# EAGLE board cpu_module (EAGLE 6.4)
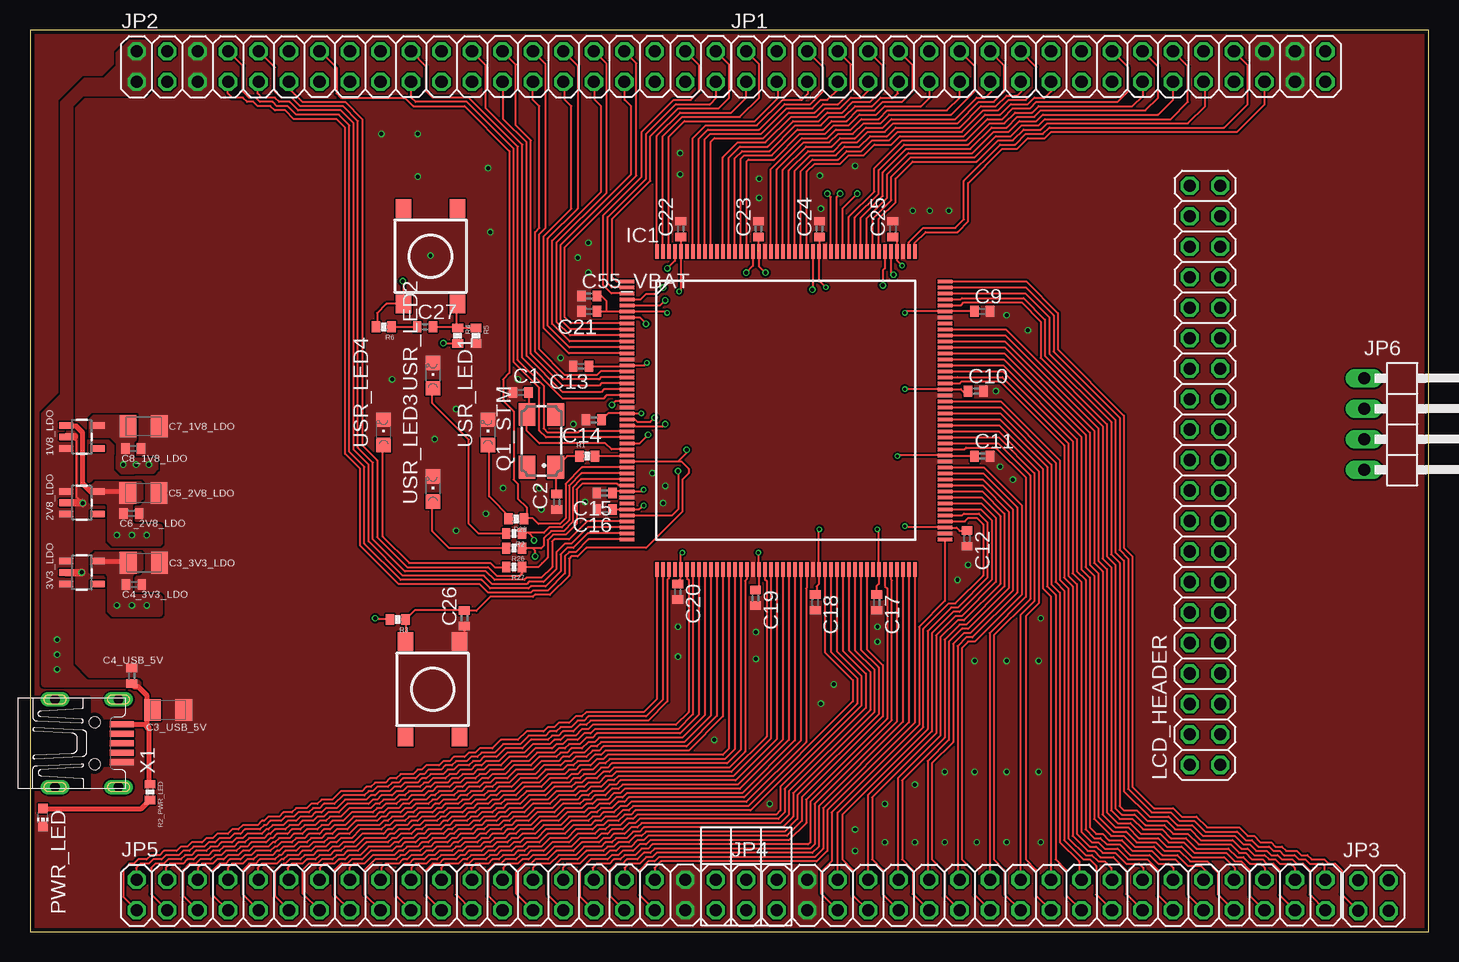
[diagram p3: board, top side]
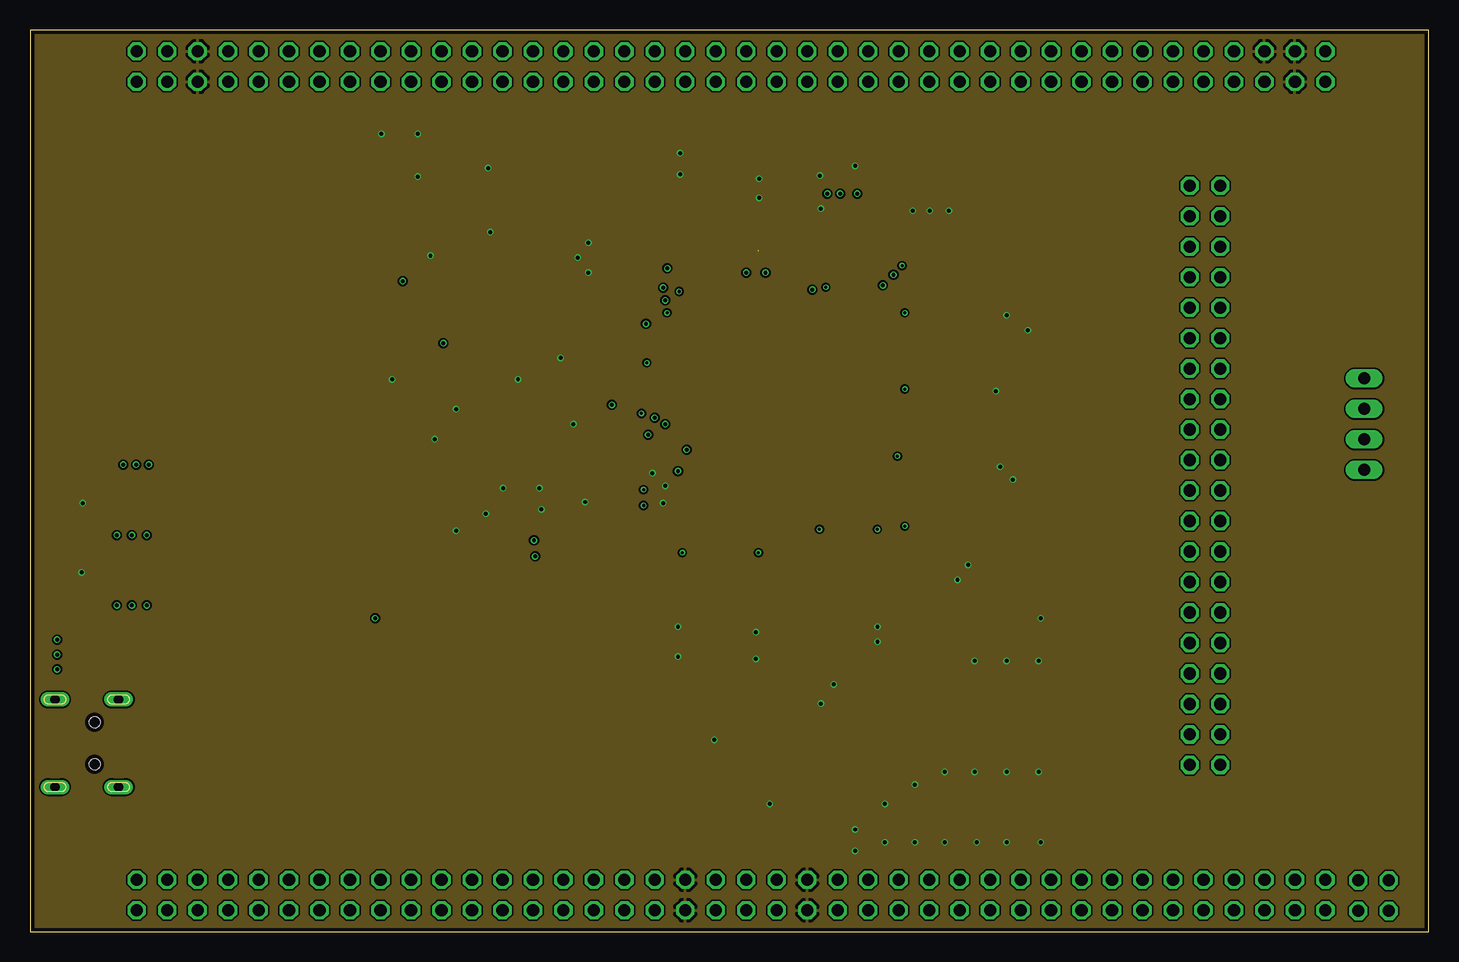
[diagram p4: board, inner layer Route2]
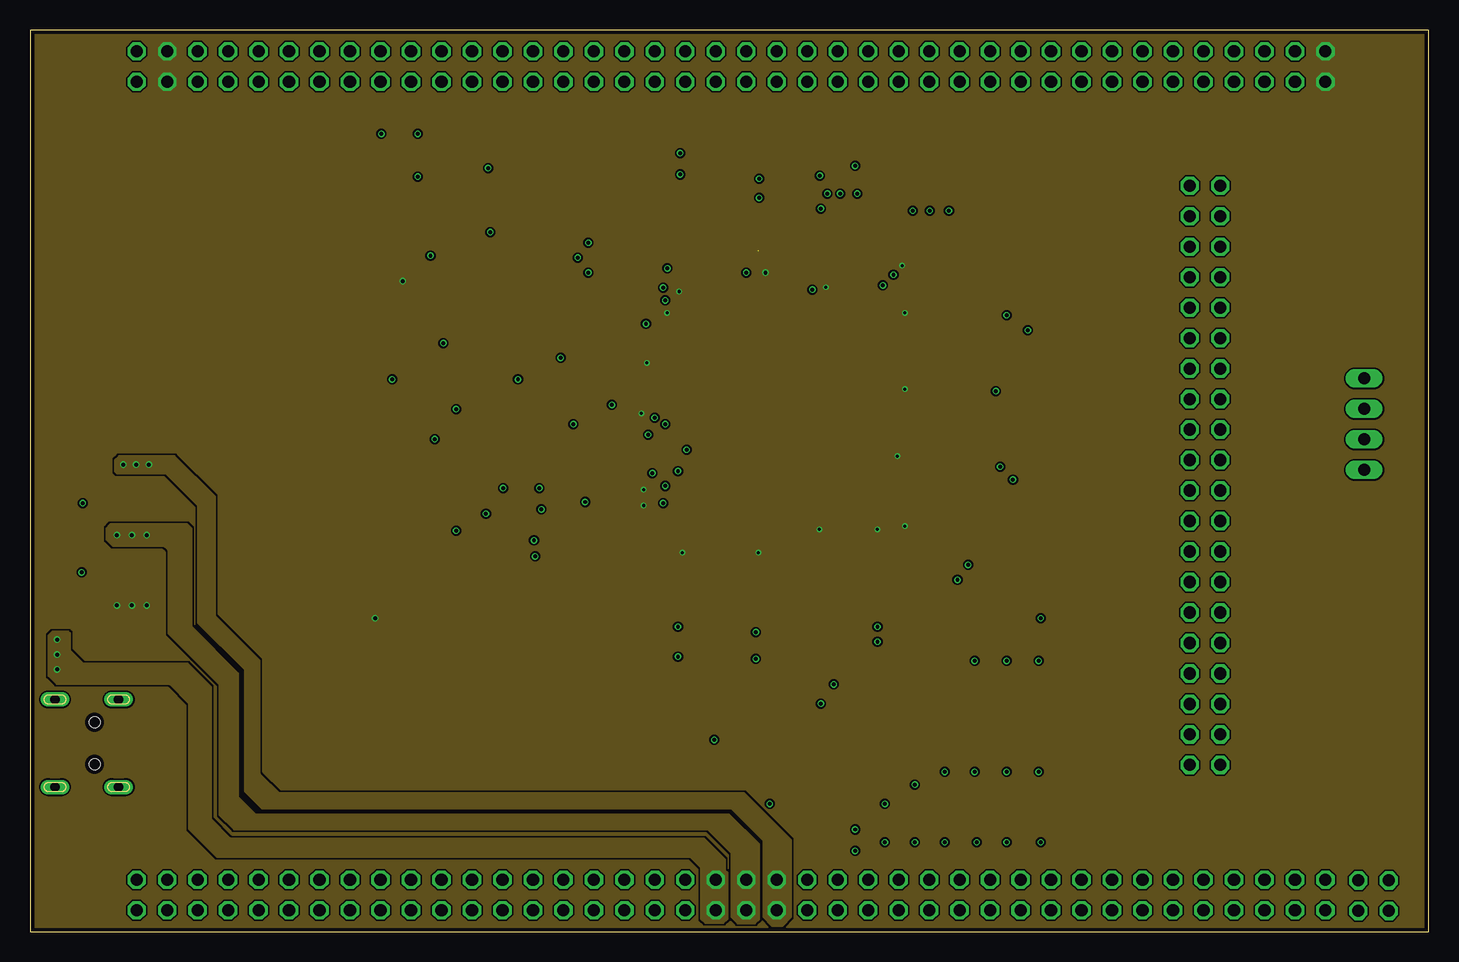
[diagram p5: board, inner layer Route3]
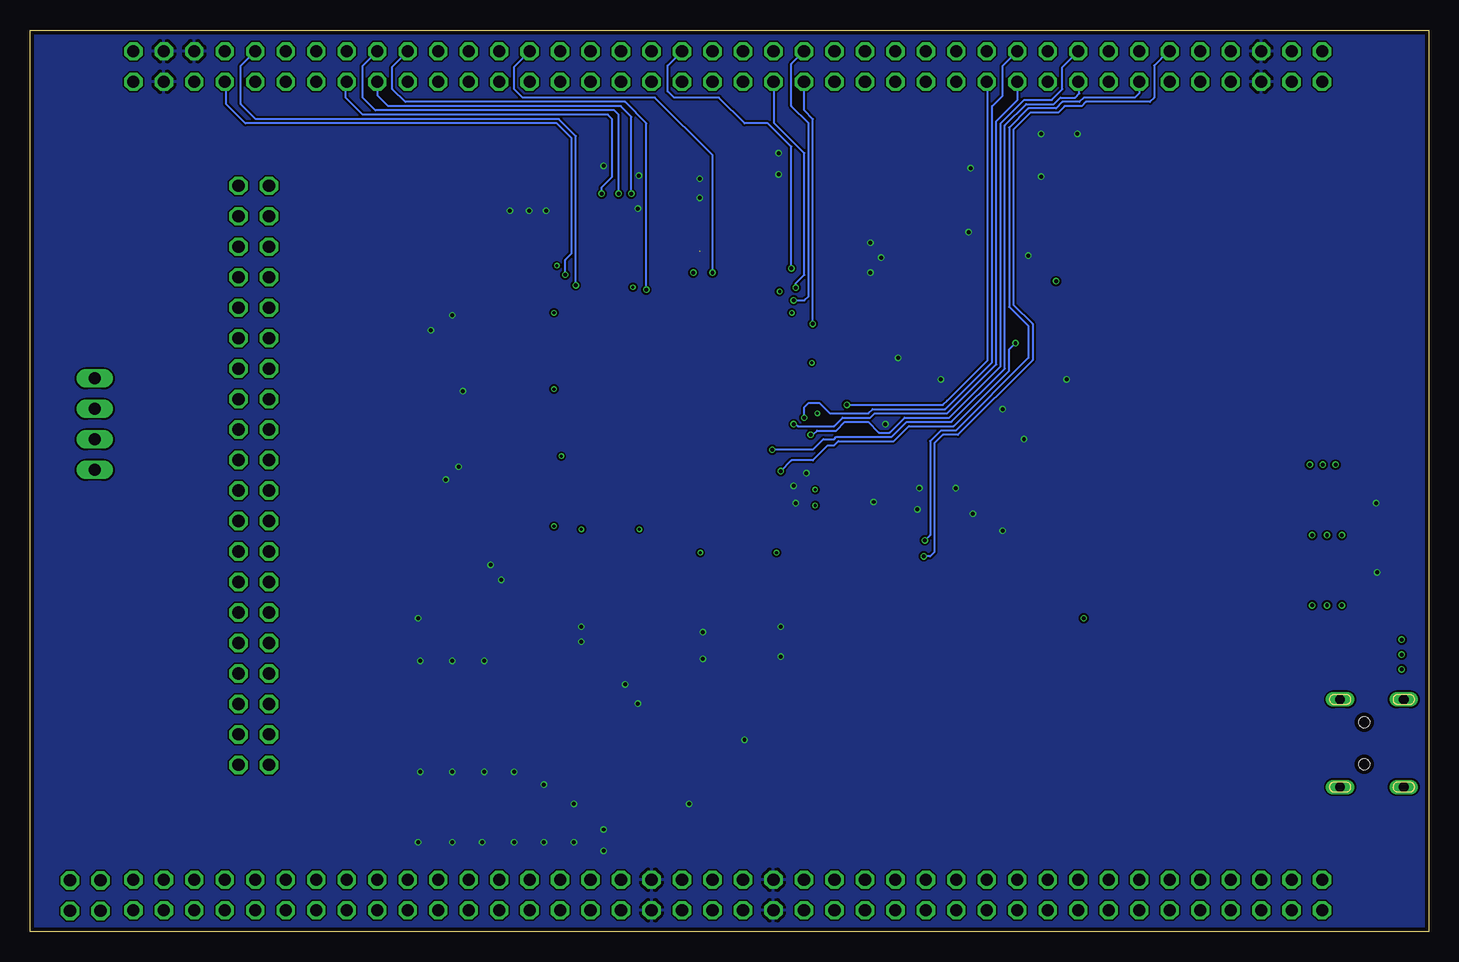
[diagram p6: board, bottom side, seen from below]

Size 116.57 x 75.13 mm. Coordinates in mm from the lower left corner, seen from the top.
Outline: 0,0 116.57,0 116.57,75.13 0,75.13 0,0
Copper layers (1*2*3*16): Top 0.035559375mm / dielectric 0.17018125mm / Route2 0.01778125mm / dielectric 47mil / Route3 0.01778125mm / dielectric 0.17018125mm / Bottom 0.035mm
Design rules "default *": minimum track width 5mil, minimum drill 10mil, track to track 5mil, track to pad 5mil, pad to pad 5mil, via to via 5mil, smd to smd 5mil, copper to edge 13mil, drill to drill 10mil, minimum pad ring 4mil, minimum via ring 4mil, stop-mask expansion 4mil, vias tented up to drill 15mil, thermal gap 10mil

## Footprints (pad centres in the part's own frame; a part is rotated, then mirrored left to right if it is on the bottom)
SOT23-5 = smd 0.55 x 1.2: 1 -0.95,-1.3; 2 0,-1.3; 3 0.95,-1.3; 4 0.95,1.3; 5 -0.95,1.3
C0402 = smd 0.7 x 0.9: 1 -0.65,0; 2 0.65,0
SMC_A = smd 1.4 x 1.8: + -1.3,0; - 1.3,0
LQFP-176 = smd 1.2 x 0.3: 1 -13.25,10.75; 2 -13.25,10.25; 3 -13.25,9.75; 4 -13.25,9.25; 5 -13.25,8.75; 6 -13.25,8.25; 7 -13.25,7.75; 8 -13.25,7.25; 9 -13.25,6.75; 10 -13.25,6.25; 11 -13.25,5.75; 12 -13.25,5.25; 13 -13.25,4.75; 14 -13.25,4.25; 15 -13.25,3.75; 16 -13.25,3.25; 17 -13.25,2.75; 18 -13.25,2.25; 19 -13.25,1.75; 20 -13.25,1.25; 21 -13.25,0.75; 22 -13.25,0.25; 23 -13.25,-0.25; 24 -13.25,-0.75; 25 -13.25,-1.25; 26 -13.25,-1.75; 27 -13.25,-2.25; 28 -13.25,-2.75; 29 -13.25,-3.25; 30 -13.25,-3.75; 31 -13.25,-4.25; 32 -13.25,-4.75; 33 -13.25,-5.25; 34 -13.25,-5.75; 35 -13.25,-6.25; 36 -13.25,-6.75; 37 -13.25,-7.25; 38 -13.25,-7.75; 39 -13.25,-8.25; 40 -13.25,-8.75; 41 -13.25,-9.25; 42 -13.25,-9.75; 43 -13.25,-10.25; 44 -13.25,-10.75; 89 13.25,-10.75; 90 13.25,-10.25; 91 13.25,-9.75; 92 13.25,-9.25; 93 13.25,-8.75; 94 13.25,-8.25; 95 13.25,-7.75; 96 13.25,-7.25; 97 13.25,-6.75; 98 13.25,-6.25; 99 13.25,-5.75; 100 13.25,-5.25; 101 13.25,-4.75; 102 13.25,-4.25; 103 13.25,-3.75; 104 13.25,-3.25; 105 13.25,-2.75; 106 13.25,-2.25; 107 13.25,-1.75; 108 13.25,-1.25; 109 13.25,-0.75; 110 13.25,-0.25; 111 13.25,0.25; 112 13.25,0.75; 113 13.25,1.25; 114 13.25,1.75; 115 13.25,2.25; 116 13.25,2.75; 117 13.25,3.25; 118 13.25,3.75; 119 13.25,4.25; 120 13.25,4.75; 121 13.25,5.25; 122 13.25,5.75; 123 13.25,6.25; 124 13.25,6.75; 125 13.25,7.25; 126 13.25,7.75; 127 13.25,8.25; 128 13.25,8.75; 129 13.25,9.25; 130 13.25,9.75; 131 13.25,10.25; 132 13.25,10.75 | smd 0.3 x 1.2: 45 -10.75,-13.25; 46 -10.25,-13.25; 47 -9.75,-13.25; 48 -9.25,-13.25; 49 -8.75,-13.25; 50 -8.25,-13.25; 51 -7.75,-13.25; 52 -7.25,-13.25; 53 -6.75,-13.25; 54 -6.25,-13.25; 55 -5.75,-13.25; 56 -5.25,-13.25; 57 -4.75,-13.25; 58 -4.25,-13.25; 59 -3.75,-13.25; 60 -3.25,-13.25; 61 -2.75,-13.25; 62 -2.25,-13.25; 63 -1.75,-13.25; 64 -1.25,-13.25; 65 -0.75,-13.25; 66 -0.25,-13.25; 67 0.25,-13.25; 68 0.75,-13.25; 69 1.25,-13.25; 70 1.75,-13.25; 71 2.25,-13.25; 72 2.75,-13.25; 73 3.25,-13.25; 74 3.75,-13.25; 75 4.25,-13.25; 76 4.75,-13.25; 77 5.25,-13.25; 78 5.75,-13.25; 79 6.25,-13.25; 80 6.75,-13.25; 81 7.25,-13.25; 82 7.75,-13.25; 83 8.25,-13.25; 84 8.75,-13.25; 85 9.25,-13.25; 86 9.75,-13.25; 87 10.25,-13.25; 88 10.75,-13.25; 133 10.75,13.25; 134 10.25,13.25; 135 9.75,13.25; 136 9.25,13.25; 137 8.75,13.25; 138 8.25,13.25; 139 7.75,13.25; 140 7.25,13.25; 141 6.75,13.25; 142 6.25,13.25; 143 5.75,13.25; 144 5.25,13.25; 145 4.75,13.25; 146 4.25,13.25; 147 3.75,13.25; 148 3.25,13.25; 149 2.75,13.25; 150 2.25,13.25; 151 1.75,13.25; 152 1.25,13.25; 153 0.75,13.25; 154 0.25,13.25; 155 -0.25,13.25; 156 -0.75,13.25; 157 -1.25,13.25; 158 -1.75,13.25; 159 -2.25,13.25; 160 -2.75,13.25; 161 -3.25,13.25; 162 -3.75,13.25; 163 -4.25,13.25; 164 -4.75,13.25; 165 -5.25,13.25; 166 -5.75,13.25; 167 -6.25,13.25; 168 -6.75,13.25; 169 -7.25,13.25; 170 -7.75,13.25; 171 -8.25,13.25; 172 -8.75,13.25; 173 -9.25,13.25; 174 -9.75,13.25; 175 -10.25,13.25; 176 -10.75,13.25
2X20 = drill 1.016 octagon: 1 -24.13,-1.27; 2 -24.13,1.27; 3 -21.59,-1.27; 4 -21.59,1.27; 5 -19.05,-1.27; 6 -19.05,1.27; 7 -16.51,-1.27; 8 -16.51,1.27; 9 -13.97,-1.27; 10 -13.97,1.27; 11 -11.43,-1.27; 12 -11.43,1.27; 13 -8.89,-1.27; 14 -8.89,1.27; 15 -6.35,-1.27; 16 -6.35,1.27; 17 -3.81,-1.27; 18 -3.81,1.27; 19 -1.27,-1.27; 20 -1.27,1.27; 21 1.27,-1.27; 22 1.27,1.27; 23 3.81,-1.27; 24 3.81,1.27; 25 6.35,-1.27; 26 6.35,1.27; 27 8.89,-1.27; 28 8.89,1.27; 29 11.43,-1.27; 30 11.43,1.27; 31 13.97,-1.27; 32 13.97,1.27; 33 16.51,-1.27; 34 16.51,1.27; 35 19.05,-1.27; 36 19.05,1.27; 37 21.59,-1.27; 38 21.59,1.27; 39 24.13,-1.27; 40 24.13,1.27
2X02 = drill 1.016 octagon: 1 -1.27,-1.27; 2 -1.27,1.27; 3 1.27,-1.27; 4 1.27,1.27
1X04/90 = drill 1.016 long: 1 -3.81,-3.81; 2 -1.27,-3.81; 3 1.27,-3.81; 4 3.81,-3.81
CHIP-LED0603 = smd 0.8 x 0.8: A 0,-0.75; C 0,0.75
CTS406 = smd 1.9 x 1.4: 1 -2.2,-1.2; 2 2.2,-1.2; 3 2.2,1.2; 4 -2.2,1.2
0402-RES = smd 0.7 x 0.9: 1 -0.65,0; 2 0.65,0
TACTILE_SWITCH_TALL = smd 1.55 x 1.3: A1 -3.975,-2.25; A2 3.975,-2.25; B1 -3.975,2.25; B2 3.975,2.25
CHIPLED_0805 = smd 1.2 x 1.2: A 0,-1.05; C 0,1.05
UX60-MB-5S8 = smd 2 x 0.5: 1 8.65,1.6; 2 8.65,0.8; 3 8.65,0; 4 8.65,-0.8; 5 8.65,-1.6 | drill 0.8 long: M1 3.1,-3.65; M2 3.1,3.65; M3 8.4,3.65; M4 8.4,-3.65 | hole 0.9: 6.4,-1.75; 6.4,1.75

## Placement (x,y rotation side)
1V8_LDO  V_REG_LDOSMD  [SOT23-5]  4.32,41.22 270 top
2V8_LDO  V_REG_LDOSMD  [SOT23-5]  4.32,35.74 270 top
3V3_LDO  V_REG_LDOSMD  [SOT23-5]  4.32,29.92 270 top
C1  20pF  [C0402]  40.89,44.93 0 top
C2  20pF  [C0402]  43.89,35.81 90 top
C3_3V3_LDO  10uF  [SMC_A]  9.5,30.73 0 top
C3_USB_5V  10uF  [SMC_A]  11.51,18.47 0 top
C4_3V3_LDO  .1uF  [C0402]  8.66,28.93 0 top
C4_USB_5V  .1uF  [C0402]  8.48,21.31 90 top
C5_2V8_LDO  10uF  [SMC_A]  9.45,36.55 0 top
C6_2V8_LDO  .1uF  [C0402]  8.46,34.85 0 top
C7_1V8_LDO  10uF  [SMC_A]  9.47,42.11 0 top
C8_1V8_LDO  .1uF  [C0402]  8.61,40.26 0 top
C9  100nF  [C0402]  79.35,51.69 0 top
C10  100nF  [C0402]  78.82,45.03 0 top
C11  100nF  [C0402]  79.35,39.62 0 top
C12  100nF  [C0402]  78.08,32.77 270 top
C13  100nF  [C0402]  45.92,47.12 180 top
C14  100nF  [C0402]  46.99,42.65 180 top
C15  100nF  [C0402]  47.88,36.55 180 top
C16  100nF  [C0402]  47.88,35.18 180 top
C17  100nF  [C0402]  70.56,27.43 270 top
C18  100nF  [C0402]  65.43,27.43 270 top
C19  100nF  [C0402]  60.45,27.81 270 top
C20  100nF  [C0402]  53.98,28.32 270 top
C21  100nF  [C0402]  46.61,51.69 180 top
C22  100nF  [C0402]  54.23,58.55 90 top
C23  100nF  [C0402]  60.71,58.55 90 top
C24  100nF  [C0402]  65.79,58.55 90 top
C25  100nF  [C0402]  71.91,58.55 90 top
C26  100nF  [C0402]  36.2,26.11 90 top
C27  100nF  [C0402]  32.92,50.39 0 top
C55_VBAT  1uF  [C0402]  46.61,52.96 0 top
IC1  STM32F439IIT  [LQFP-176]  62.99,43.43 0 top
JP1  [2X20]  83.82,72.09 0 top
JP2  [2X20]  33.02,72.09 0 top
JP3  [2X02]  111.96,3 0 top
JP4  [2X20]  83.82,3.05 0 top
JP5  [2X20]  33.02,3.05 0 top
JP6  [1X04/90]  114.99,42.29 270 top
LCD_HEADER  [2X20]  97.92,38.02 90 top
PWR_LED  [CHIP-LED0603]  1.07,9.5 180 top
Q1_STM  8MHz  [CTS406]  42.62,40.89 90 top
R1  220  [0402-RES]  46.43,39.62 0 top
R2  33  [0402-RES]  40.34,33.17 180 top
R2_PWR_LED  [0402-RES]  10.01,11.63 270 top
R3  100K  [0402-RES]  30.66,26.01 180 top
R4  330  [0402-RES]  35.64,49.66 270 top
R5  220K  [0402-RES]  37.16,49.66 270 top
R6  100  [0402-RES]  29.49,50.39 180 top
R26  33  [0402-RES]  40.34,31.95 180 top
R27  33  [0402-RES]  40.34,30.38 180 top
R28  33  [0402-RES]  40.51,34.39 180 top
S1_RST  SWITCH-MOMENTARY-2  [TACTILE_SWITCH_TALL]  33.55,20.19 90 top
S2_USR_WKP  SWITCH-MOMENTARY-2  [TACTILE_SWITCH_TALL]  33.38,56.29 270 top
USR_LED1  [CHIPLED_0805]  38.15,41.61 0 top
USR_LED2  [CHIPLED_0805]  33.58,46.33 0 top
USR_LED3  [CHIPLED_0805]  33.58,36.88 0 top
USR_LED4  [CHIPLED_0805]  29.46,41.61 0 top
X1  MINI-USB-UX60-MB-5S8  [UX60-MB-5S8]  -1.02,15.7 0 top

## Tracks (layer width: path | path; a pad name or v marks a point on that pad's centre or on a via)
1V8  (via drill 0.33)
  Top 0.406: 8.11,42.17 C7_1V8_LDO.+
  other vias: 7.77,38.91 8.84,38.91 9.91,38.91
  pour Top (no thermals): 4.93,42.65 4.93,41.22 6.71,41.22 7.24,40.69 7.24,38.56 7.59,38.2 8.66,38.2 8.66,40.87 8.84,41.05 8.84,43 5.28,43
  pour Top (rank 5, no thermals): 7.24,39.62 8.31,39.62 8.48,39.45 10.26,39.45 10.62,39.09 10.62,38.56 10.26,38.2 7.59,38.2 7.24,38.56
  pour Route3 (rank 5, no thermals): 7.06,38.91 7.06,38.38 7.24,38.2 11.33,38.2 14,35.53 14,25.76 17.91,21.84 17.91,11.71 19.33,10.29 58.45,10.29 61.11,7.62 61.11,1.22 61.82,0.51 62.71,0.51 63.42,1.22 63.42,7.62 59.51,11.53 20.75,11.53 19.15,13.13 19.15,22.56 15.42,26.29 15.42,36.25 12.04,39.62 7.42,39.62 7.06,39.27
2V8  (via drill 0.33)
  Top 0.406: C5_2V8_LDO.+ 8.01,36.69 2V8_LDO.5 5.02,36.69 4.39,37.31 4.39,41.58 3.86,42.11 3.08,42.11 1V8_LDO.1
  other vias: 7.24,33.05 8.48,33.05 9.73,33.05
  pour Top (rank 5, no thermals): 5.11,37.13 5.46,37.49 9.19,37.49 9.37,37.31 9.37,36.07 9.02,35.71 8.66,35.71 8.48,35.53 8.48,34.11 8.66,33.93 10.8,33.93 10.97,33.76 10.97,32.33 10.8,32.16 6.88,32.16 6.53,32.51 6.53,35.53 6.35,35.71 5.28,35.71 5.11,35.89
  pour Route3 (rank 5, no thermals): 6.35,33.58 6.35,32.69 6.88,32.16 11.15,32.16 11.51,31.8 11.51,24.87 15.77,20.6 15.77,9.75 17.02,8.51 56.49,8.51 58.45,6.55 58.45,1.22 58.98,0.69 60.4,0.69 60.76,1.04 60.76,7.26 58.27,9.75 18.8,9.75 17.37,11.18 17.37,21.49 13.46,25.4 13.46,33.58 13.11,33.93 6.71,33.93
3V3  (via drill 0.25, 0.33)  (1 unrouted)
  Top 0.152: v54.1,53.34 54.24,53.48 IC1.172 54.23,56.7 C22.1 | v72.9,33.78 73,33.68 IC1.91 76.27,33.66 | v72.29,39.62 72.35,39.68 IC1.103 76.3,39.62 C11.1 | v72.9,45.21 72.93,45.18 IC1.114 76.27,45.21 | v72.9,51.56 73.02,51.68 IC1.127 C9.1 | v51.13,35.51 50.74,35.18 IC1.39 C16.1 | v51.13,36.83 50.98,36.68 IC1.36 48.66,36.68 C15.1 | v54.36,31.57 54.24,31.46 IC1.49 54.23,30.17 54.23,29.46 53.98,29.21 C20.1 | IC1.62 60.74,31.54 v60.71,31.57 | IC1.72 65.74,33.48 v65.79,33.53 | IC1.82 70.74,33.4 v70.61,33.53 | C13.1 49.67,47.12 IC1.15 51.2,47.18 v51.41,47.4 | IC1.23 v50.95,43.18 | C23.1 60.71,56.72 | C24.1 65.79,56.73 IC1.149 | 72.26,56.71 IC1.136 | v53.09,51.56 52.96,51.68 IC1.6 48.01,51.69 | C21.1 48.01,51.69 | C55_VBAT.2 47.62,52.96 48.01,52.58 48.01,51.69
  Top 0.178: IC1.136 72.24,55.93 v72.67,55.5 | IC1.149 65.74,54.2 65.82,54.2 v66.32,53.7 | 76.27,33.66 77.22,33.66 77.47,33.4 78.06,33.4 C12.1 | 76.27,45.21 77.57,45.21 77.83,44.96 78.45,44.96 C10.1 | R6.2 28.93,50.48 28.93,51.54 29.7,52.31 S2_USR_WKP.A2 31.13,54.14 v31.06,54.2 | IC1.82 70.74,28.98 70.54,28.78 70.54,28.11 C17.1 | IC1.72 65.74,28.96 65.56,28.78 65.56,28.13 C18.1 | IC1.62 60.74,28.75 C19.1 | IC1.23 48.17,43.18 C14.1 | R3.2 28.85,26.01 v28.75,26.11 | 72.26,56.71 72.26,57.54 C25.1 | IC1.159 60.74,55.46 v61.29,54.91
  Top 0.406: 3V3_LDO.5 7.91,30.87 C3_3V3_LDO.+
  other vias: 7.24,27.18 8.48,27.18 9.73,27.18
  pour Route3 (isolate 0.152, rank 6, no thermals): 116.33,74.88 0.25,74.88 0.25,0.25 116.33,0.25
  pour Top (rank 5, no thermals): 5.11,31.27 5.46,31.62 9.19,31.62 9.37,31.45 9.37,30.2 9.02,29.84 8.66,29.84 8.48,29.67 8.48,28.24 8.66,28.07 10.8,28.07 10.97,27.89 10.97,26.47 10.8,26.29 6.88,26.29 6.53,26.64 6.53,29.67 6.35,29.84 5.28,29.84 5.11,30.02
GND  (via drill 0.33)
  Top 0.178: C26.1 36.2,24.56 S1_RST.A2 | 3.68,41.22 3.68,41.05 3.86,40.87 3.86,36.25 v4.39,35.71
  Top 0.61: 2V8_LDO.2 4.37,35.74 v4.39,35.71 | 3V3_LDO.2 4.29,29.92 v4.3,29.93 | 1V8_LDO.2 3.68,41.22
  other vias: 44.22,47.8 54.18,64.87 54.18,63.09 60.76,62.74 60.76,61.14 65.82,63 65.91,60.25 68.76,63.8 45.64,56.16 46.53,57.4 46.53,54.91 45.29,42.29 73.56,60.07 74.98,60.07 76.58,60.07 80.49,45.05 80.85,38.73 81.92,37.67 70.62,25.4 70.62,24.16 77.29,29.31 78.18,30.56 84.23,26.11 84.05,22.56 84.05,13.31 84.23,7.44 78.89,7.44 78.71,13.31 78.71,22.56 76.23,13.31 76.23,7.44 68.76,8.51 68.76,6.73 61.65,10.64 81.38,7.44 81.38,13.31 81.38,22.56 71.25,7.44 71.25,10.64 73.74,12.24 73.74,7.44 40.67,46.02 46.27,35.8 29.29,66.47 32.31,66.47 32.31,62.92 38.18,63.63 38.35,58.29 33.38,56.34 30.18,46.02 35.51,43.54 33.73,41.05 39.42,36.96 38,34.82 35.51,33.4 42.44,36.96 42.62,35.18 51.87,38.2 52.93,37.13 52.76,35.71 54,22.91 54,25.4 60.49,24.96 60.49,22.73 65.91,19 66.98,20.6 57.02,15.98 81.38,51.36 83.16,50.11
  pour Bottom (isolate 0.152, rank 6): 116.33,74.88 0.25,74.88 0.25,0.25 116.33,0.25
  pour Route2 (isolate 0.152, rank 6): 116.33,74.88 0.25,74.88 0.25,0.25 116.33,0.25
  pour Top (isolate 0.152, rank 6, no thermals): 0.25,74.88 0.25,0.25 116.33,0.25 116.33,74.88
N$1
  Top 0.406: PWR_LED.A 9.27,10.25 R2_PWR_LED.2
N$2
  Top 0.152: R1.1 44.75,39.62 Q1_STM.1 43.82,36.53
  Top 0.203: 44.16,38.35 Q1_STM.1 | 43.82,36.53 C2.2
N$3
  Top 0.178: C27.2 35.55,50.39 | 35.55,50.39 R4.1 R5.1 | 35.55,50.39 35.55,52.23 S2_USR_WKP.B2
N$4
  Top 0.178: R6.1 C27.1
N$19
  Top 0.152: R28.2 40.04,34.48 38.25,36.27 38.25,40.45 USR_LED1.A
N$20
  Top 0.152: USR_LED2.A 33.53,45.23 33.53,44.04 36.58,41 36.58,33.98 37.39,33.17 R2.2
N$21
  Top 0.152: R26.2 34.95,31.95 33.53,33.38 33.53,35.78 USR_LED3.A
N$22
  Top 0.152: USR_LED4.A 29.41,40.5 29.41,32.92 31.6,30.73 38.35,30.73 38.71,30.38 R27.2
NRST  (via drill 0.33)
  Top 0.178: 50.72,39.18 IC1.31 54,39.18 | S1_RST.B2 R3.1 32.06,26.76 C26.2 36.22,26.73 37.2,26.73 38.35,27.89 41.91,27.89 42.09,28.07 43.33,28.07 44.93,29.67 44.93,31.09 45.11,31.27 45.64,31.27 46.36,31.98 51.33,31.98 54.36,35 54.36,37.67 54.89,38.2 54.89,38.56 54.26,39.18 54,39.18 | v54.71,40.16 54.71,39.9 54,39.18
  Bottom 0.178: JP2.17 29.11,70.71 29.11,69.85 29.46,69.49 30.71,69.49 31.24,68.96 33.55,68.96 35.33,67.18 35.33,46.91 39.78,42.47 43.51,42.47 44.75,41.22 49.38,41.22 49.56,41.05 50.44,41.05 51.33,40.16 v54.71,40.16
OSC_IN
  Top 0.152: IC1.29 48.46,40.18 47.95,40.69 42.44,40.69 41.38,41.76 41.38,43.05 Q1_STM.3
  Top 0.178: C1.2 41.54,43.22 Q1_STM.3
  Top 0.203: 41.35,43.02 Q1_STM.3 41.35,43.16
OSC_OUT
  Top 0.152: 49.68,39.62 R1.2
  Top 0.203: 49.68,39.62 IC1.30
PA0_WKUP  (via drill 0.33)
  Top 0.178: IC1.40 53.5,34.68 54,35.18 v54,38.38 | v34.44,49.05 35.6,49.05 R4.2
  Bottom 0.178: v34.44,49.05 34.98,48.51 34.98,46.74 39.6,42.11 43.33,42.11 44.58,40.87 49.2,40.87 49.56,40.51 50.09,40.51 51.33,39.27 53.11,39.27 v54,38.38
PA1
  Top 0.178: IC1.41 46.43,34.18 44.93,32.69 43.69,32.69 43.51,32.51 43.51,30.38 42.62,29.49 41.38,29.49 41.2,29.31 38.71,29.31 38,30.02 31.24,30.02 28.58,32.69 28.58,39.09 27.33,40.34 27.33,67.54 26.09,68.78 22.53,68.78 21.82,69.49 20.93,69.49 20.4,70.03 20.4,72.01 JP2.10
PA2
  Top 0.178: IC1.42 46.46,33.68 45.11,32.33 44.58,32.33 43.87,31.62 43.87,30.2 42.8,29.13 41.55,29.13 41.38,28.96 38.53,28.96 37.82,29.67 31.06,29.67 28.22,32.51 28.22,38.91 26.98,40.16 26.98,67.36 25.91,68.43 22.35,68.43 21.64,69.14 20.75,69.14 20.4,69.49 19.33,69.49 18.97,69.85 18.97,70.74 JP2.9
PA3
  Top 0.178: JP5.3 10.08,3.12 10.08,5.31 10.44,5.66 11.15,5.66 11.51,6.02 12.57,6.02 12.93,6.38 13.46,6.38 13.82,6.73 14.71,6.73 15.06,7.09 15.6,7.09 15.95,7.44 16.84,7.44 17.2,7.8 17.73,7.8 18.09,8.15 19.33,8.15 19.69,8.51 19.86,8.51 20.22,8.87 21.11,8.87 21.46,9.22 22.17,9.22 22.53,9.58 23.42,9.58 23.77,9.93 24.31,9.93 24.66,10.29 25.55,10.29 26.26,11 28.04,11 28.4,11.35 28.75,11.35 29.11,11.71 30,11.71 30.35,12.06 30.89,12.06 31.24,12.42 32.31,12.42 32.66,12.78 33.02,12.78 33.38,13.13 34.44,13.13 34.8,13.49 35.33,13.49 35.69,13.84 36.58,13.84 36.93,14.2 37.47,14.2 37.82,14.55 38.89,14.55 39.6,15.26 41.02,15.26 41.73,15.98 43.16,15.98 43.51,16.33 44.04,16.33 44.4,16.69 45.29,16.69 45.82,17.22 46.36,17.22 46.71,17.58 51.51,17.58 53.11,19.18 53.11,29.31 53.24,29.44 IC1.47
PA4
  Top 0.178: JP5.4 11.33,4.42 11.33,5.31 11.68,5.66 12.75,5.66 13.11,6.02 13.64,6.02 14,6.38 14.88,6.38 15.24,6.73 15.77,6.73 16.13,7.09 17.02,7.09 17.37,7.44 17.91,7.44 18.26,7.8 19.51,7.8 19.86,8.15 20.04,8.15 20.4,8.51 21.28,8.51 21.64,8.87 22.35,8.87 22.71,9.22 23.6,9.22 23.95,9.58 24.49,9.58 24.84,9.93 25.73,9.93 26.44,10.64 28.22,10.64 28.58,11 28.93,11 29.29,11.35 30.17,11.35 30.53,11.71 31.06,11.71 31.42,12.06 32.49,12.06 32.84,12.42 33.2,12.42 33.55,12.78 34.62,12.78 34.98,13.13 35.51,13.13 35.87,13.49 36.75,13.49 37.11,13.84 37.64,13.84 38,14.2 39.06,14.2 39.78,14.91 41.2,14.91 41.91,15.62 43.33,15.62 43.69,15.98 44.22,15.98 44.58,16.33 45.47,16.33 46,16.87 46.53,16.87 46.89,17.22 53.82,17.22 54.89,18.29 54.89,29.31 54.74,29.46 IC1.50
PA5
  Top 0.178: IC1.51 55.24,18.11 54,16.87 47.07,16.87 46.71,16.51 46.18,16.51 45.64,15.98 44.75,15.98 44.4,15.62 43.87,15.62 43.51,15.26 42.09,15.26 41.38,14.55 39.95,14.55 39.24,13.84 38.18,13.84 37.82,13.49 37.29,13.49 36.93,13.13 36.04,13.13 35.69,12.78 35.15,12.78 34.8,12.42 33.73,12.42 33.38,12.06 33.02,12.06 32.66,11.71 31.6,11.71 31.24,11.35 30.71,11.35 30.35,11 29.46,11 29.11,10.64 28.75,10.64 28.4,10.29 26.62,10.29 25.91,9.58 25.02,9.58 24.66,9.22 24.13,9.22 23.77,8.87 22.89,8.87 22.53,8.51 21.82,8.51 21.46,8.15 20.57,8.15 20.22,7.8 20.04,7.8 19.69,7.44 18.44,7.44 18.09,7.09 17.55,7.09 17.2,6.73 16.31,6.73 15.95,6.38 15.42,6.38 15.06,6.02 14.17,6.02 13.82,5.66 13.28,5.66 12.75,5.13 12.75,3 JP5.5
PA6
  Top 0.178: IC1.52 55.74,18.07 54.18,16.51 47.24,16.51 46.89,16.15 46.36,16.15 45.82,15.62 44.93,15.62 44.58,15.26 44.04,15.26 43.69,14.91 42.27,14.91 41.55,14.2 40.13,14.2 39.42,13.49 38.35,13.49 38,13.13 37.47,13.13 37.11,12.78 36.22,12.78 35.87,12.42 35.33,12.42 34.98,12.06 33.91,12.06 33.55,11.71 33.2,11.71 32.84,11.35 31.78,11.35 31.42,11 30.89,11 30.53,10.64 29.64,10.64 29.29,10.29 28.93,10.29 28.58,9.93 26.8,9.93 26.09,9.22 25.2,9.22 24.84,8.87 24.31,8.87 23.95,8.51 23.06,8.51 22.71,8.15 22,8.15 21.64,7.8 20.75,7.8 20.4,7.44 20.22,7.44 19.86,7.09 18.62,7.09 18.26,6.73 17.73,6.73 17.37,6.38 16.48,6.38 16.13,6.02 15.6,6.02 15.24,5.66 14.35,5.66 14,5.31 14,4.34 JP5.6
PA7
  Top 0.178: IC1.53 56.24,18.04 54.36,16.15 47.42,16.15 47.07,15.8 46.53,15.8 46,15.26 45.11,15.26 44.75,14.91 44.22,14.91 43.87,14.55 42.44,14.55 41.73,13.84 40.31,13.84 39.6,13.13 38.53,13.13 38.18,12.78 37.64,12.78 37.29,12.42 36.4,12.42 36.04,12.06 35.51,12.06 35.15,11.71 34.09,11.71 33.73,11.35 33.38,11.35 33.02,11 31.95,11 31.6,10.64 31.06,10.64 30.71,10.29 29.82,10.29 29.46,9.93 29.11,9.93 28.75,9.58 26.98,9.58 26.26,8.87 25.38,8.87 25.02,8.51 24.49,8.51 24.13,8.15 23.24,8.15 22.89,7.8 22.17,7.8 21.82,7.44 20.93,7.44 20.57,7.09 20.4,7.09 20.04,6.73 18.8,6.73 18.44,6.38 17.91,6.38 17.55,6.02 16.66,6.02 16.31,5.66 15.77,5.66 15.24,5.13 15.24,3.05 JP5.7
PA8
  Top 0.178: IC1.119 81.14,47.68 87.6,41.22 87.6,30.2 88.32,29.49 88.32,8.69 88.85,8.15 89.38,8.15 89.92,7.62 90.98,7.62 91.87,6.73 93.47,6.73 94.18,6.02 95.43,6.02 96.5,4.95 96.5,3.07 JP4.31
PA9
  Top 0.178: IC1.120 81.18,48.18 87.96,41.4 87.96,30.38 88.67,29.67 88.67,9.4 90.09,7.98 91.16,7.98 92.05,7.09 93.65,7.09 94.36,6.38 95.61,6.38 96.5,5.49 97.56,5.49 97.92,5.13 97.92,4.45 JP4.32
PA10
  Top 0.178: IC1.121 81.21,48.68 88.32,41.58 88.32,30.56 89.03,29.84 89.03,9.58 90.27,8.33 91.34,8.33 92.23,7.44 93.83,7.44 94.54,6.73 95.78,6.73 96.67,5.84 98.09,5.84 98.98,4.95 98.98,3.12 JP4.33
PA11
  Top 0.178: IC1.122 81.25,49.18 88.67,41.76 88.67,30.73 89.38,30.02 89.38,9.75 90.45,8.69 91.52,8.69 92.41,7.8 94,7.8 94.72,7.09 95.96,7.09 96.85,6.2 99.52,6.2 100.41,5.31 100.41,4.39 JP4.34
PA12
  Top 0.178: IC1.123 81.28,49.68 89.03,41.94 89.03,30.91 89.74,30.2 89.74,9.93 90.63,9.04 91.69,9.04 92.58,8.15 94.18,8.15 94.89,7.44 96.14,7.44 97.03,6.55 99.69,6.55 100.41,5.84 100.94,5.84 101.65,5.13 101.65,3 JP4.35
PA13
  Top 0.178: IC1.124 81.31,50.18 89.38,42.11 89.38,31.09 90.09,30.38 90.09,10.11 90.81,9.4 91.87,9.4 92.76,8.51 94.36,8.51 95.07,7.8 96.32,7.8 97.21,6.91 99.87,6.91 100.58,6.2 101.12,6.2 101.65,5.66 102.54,5.66 102.9,5.31 102.9,4.34 JP4.36
PA14  (via drill 0.33)
  Top 0.178: IC1.137 71.74,54.95 v71.96,54.74
  Bottom 0.178: v71.96,54.74 71.96,55.98 71.42,56.52 71.42,66.12 72.67,67.36 98.63,67.36 100.23,68.96 100.23,70.71 JP1.33
PA15  (via drill 0.33)
  Top 0.178: IC1.138 71.24,55.27 71.07,55.09 v71.07,53.85
  Bottom 0.178: v71.07,53.85 71.07,66.29 72.49,67.72 97.74,67.72 98.98,68.96 98.98,72.16 JP1.32
PB0
  Top 0.178: IC1.56 57.74,17.94 54.89,15.09 47.95,15.09 47.6,14.73 47.07,14.73 46.53,14.2 45.64,14.2 45.29,13.84 44.75,13.84 44.4,13.49 42.98,13.49 42.27,12.78 40.84,12.78 40.13,12.06 39.06,12.06 38.71,11.71 38.18,11.71 37.82,11.35 36.93,11.35 36.58,11 36.04,11 35.69,10.64 34.62,10.64 34.27,10.29 33.91,10.29 33.55,9.93 32.49,9.93 32.13,9.58 31.6,9.58 31.24,9.22 30.35,9.22 30,8.87 29.64,8.87 29.29,8.51 27.51,8.51 26.8,7.8 25.91,7.8 25.55,7.44 25.02,7.44 24.66,7.09 23.77,7.09 23.42,6.73 22.71,6.73 22.35,6.38 21.46,6.38 21.11,6.02 20.93,6.02 20.57,5.66 19.33,5.66 18.97,5.31 18.97,4.39 JP5.10
PB1
  Top 0.178: IC1.57 58.24,15.24 57.73,14.73 48.13,14.73 47.78,14.38 47.24,14.38 46.71,13.84 45.82,13.84 45.47,13.49 44.93,13.49 44.58,13.13 43.16,13.13 42.44,12.42 41.02,12.42 40.31,11.71 39.24,11.71 38.89,11.35 38.35,11.35 38,11 37.11,11 36.75,10.64 36.22,10.64 35.87,10.29 34.8,10.29 34.44,9.93 34.09,9.93 33.73,9.58 32.66,9.58 32.31,9.22 31.78,9.22 31.42,8.87 30.53,8.87 30.17,8.51 29.82,8.51 29.46,8.15 27.69,8.15 26.98,7.44 26.09,7.44 25.73,7.09 25.2,7.09 24.84,6.73 23.95,6.73 23.6,6.38 22.89,6.38 22.53,6.02 21.64,6.02 21.28,5.66 21.11,5.66 20.4,4.95 20.4,2.97 JP5.11
PB2
  Top 0.178: IC1.58 58.74,15.21 57.91,14.38 48.31,14.38 47.95,14.02 47.42,14.02 46.89,13.49 46,13.49 45.64,13.13 45.11,13.13 44.75,12.78 43.33,12.78 42.62,12.06 41.2,12.06 40.49,11.35 39.42,11.35 39.06,11 38.53,11 38.18,10.64 37.29,10.64 36.93,10.29 36.4,10.29 36.04,9.93 34.98,9.93 34.62,9.58 34.27,9.58 33.91,9.22 32.84,9.22 32.49,8.87 31.95,8.87 31.6,8.51 30.71,8.51 30.35,8.15 30,8.15 29.64,7.8 27.86,7.8 27.15,7.09 26.26,7.09 25.91,6.73 25.38,6.73 25.02,6.38 24.13,6.38 23.77,6.02 23.06,6.02 22.71,5.66 21.82,5.66 21.46,5.31 21.46,4.45 JP5.12
PB3
  Top 0.178: IC1.161 59.74,64.21 59.87,64.34 62,64.34 64.14,66.47 66.27,66.47 66.98,67.18 68.22,67.18 69.11,68.07 70.54,68.07 71.25,68.78 74.27,68.78 74.98,69.49 74.98,70.76 JP1.13
PB4
  Top 0.178: IC1.162 59.24,64.42 59.51,64.69 61.82,64.69 63.96,66.83 66.09,66.83 66.8,67.54 68.05,67.54 68.94,68.43 70.36,68.43 71.07,69.14 72.67,69.14 73.56,70.03 73.56,72.19 JP1.12
PB5
  Top 0.178: IC1.163 58.74,64.46 59.33,65.05 61.65,65.05 63.78,67.18 65.91,67.18 66.62,67.89 67.87,67.89 68.76,68.78 70.18,68.78 70.89,69.49 71.96,69.49 72.31,69.85 72.31,70.74 JP1.11
PB6
  Top 0.178: IC1.164 58.24,64.49 59.16,65.41 61.47,65.41 63.6,67.54 65.73,67.54 66.45,68.25 67.69,68.25 68.58,69.14 70,69.14 71.07,70.21 71.07,72.14 JP1.10
PB7
  Top 0.178: IC1.165 57.74,64.52 58.98,65.76 61.29,65.76 63.42,67.89 65.56,67.89 66.27,68.6 67.51,68.6 68.4,69.49 69.29,69.49 69.85,70.05 JP1.9
PB8
  Top 0.178: IC1.167 56.74,65.83 57.02,66.12 61.11,66.12 63.25,68.25 65.38,68.25 66.09,68.96 67.34,68.96 68.4,70.03 68.4,72.26 JP1.8
PB9
  Top 0.178: IC1.168 56.24,66.05 56.67,66.47 60.94,66.47 63.07,68.6 65.2,68.6 65.91,69.32 66.45,69.32 67.34,70.21 67.34,70.79 JP1.7
PB10
  Top 0.178: IC1.79 69.24,23.49 70.71,22.02 70.71,18.11 63.96,11.35 63.96,9.4 62.89,8.33 51.33,8.33 50.98,7.98 50.44,7.98 49.91,7.44 49.02,7.44 48.67,7.09 48.13,7.09 47.78,6.73 46.36,6.73 45.64,6.02 44.22,6.02 43.16,4.95 43.16,3.07 JP5.29
PB11
  Top 0.178: IC1.80 69.74,23.53 71.07,22.2 71.07,17.93 64.31,11.18 64.31,9.22 63.07,7.98 51.51,7.98 51.16,7.62 50.62,7.62 50.09,7.09 49.2,7.09 48.84,6.73 48.31,6.73 47.95,6.38 46.53,6.38 45.82,5.66 44.75,5.66 44.4,5.31 44.4,4.37 JP5.30
PB12
  Top 0.178: IC1.92 77.9,34.18 78.18,34.47 78.89,34.47 79.43,33.93 79.43,29.67 77.11,27.36 76.58,27.36 74.45,25.22 74.45,17.04 67.31,9.91 JP4.8
PB13
  Top 0.178: IC1.93 77.69,34.68 77.83,34.82 79.07,34.82 79.78,34.11 79.78,29.49 77.29,27 76.76,27 74.8,25.04 74.8,16.87 67.69,9.75 67.69,6.02 68.58,5.13 68.58,3.05 JP4.9
PB14
  Top 0.178: IC1.94 79.24,35.18 80.14,34.29 80.14,29.31 77.47,26.65 76.94,26.65 75.16,24.87 75.16,16.69 69.83,11.35 69.83,4.34 JP4.10
PB15
  Top 0.178: IC1.95 79.28,35.68 80.49,34.47 80.49,29.13 77.65,26.29 77.11,26.29 75.51,24.69 75.51,16.51 70.18,11.18 70.18,6.02 71.07,5.13 71.07,3.1 JP4.11
PC0
  Top 0.152: IC1.32 46,38.68 44.63,37.31 44.63,34.44 44.17,33.98 42.37,33.98 41.91,34.44 41.39,34.44 R28.1
  Top 0.178: JP2.14 24.18,73.35 25.55,71.98 25.55,69.85 25.91,69.49 31.24,69.49 31.95,68.78 36.22,68.78 39.95,65.05 39.95,46.56 39.42,46.02 39.42,44.25 40.31,43.36 40.31,37.67 40.67,37.31 40.67,36.07 41.38,35.36 41.38,34.43 R28.1
PC1  (via drill 0.33)
  Top 0.152: IC1.33 45.96,38.18 44.93,37.16 44.93,34.29 44.32,33.68 43.28,33.68 42.82,33.22 41.55,33.22 41.39,33.22 R2.1
  Top 0.178: v42,32.6 42,32.78 41.55,33.22
  Bottom 0.178: JP2.13 24.13,69.85 24.49,69.49 28.75,69.49 29.11,69.14 30.53,69.14 31.06,68.6 33.38,68.6 34.98,67 34.98,52.07 33.38,50.47 33.38,47.8 39.42,41.76 40.67,41.76 41.55,40.87 41.55,33.05 v42,32.6
PC2  (via drill 0.33)
  Top 0.152: IC1.34 45.91,37.68 45.24,37.01 45.24,34.14 44.48,33.38 43.43,33.38 42.82,32.77 42.82,32.16 42.6,31.93 41.91,31.93 41.37,31.93 R26.1
  Top 0.178: v42.09,31.27 42.09,31.75 41.91,31.93
  Bottom 0.178: JP2.12 21.69,73.35 22.89,72.16 22.89,69.49 23.24,69.14 28.58,69.14 28.93,68.78 30.35,68.78 30.89,68.25 33.2,68.25 34.62,66.83 34.62,52.25 33.02,50.65 33.02,47.62 39.24,41.4 40.49,41.4 41.2,40.69 41.2,31.62 41.55,31.27 v42.09,31.27
PC3
  Top 0.152: IC1.35 49.05,37.18 48.89,37.34 46.03,37.34 45.54,36.86 45.54,33.98 44.63,33.07 43.59,33.07 43.13,32.61 43.13,31.17 42.67,30.71 42.67,30.7 42.35,30.38 R27.1
  Top 0.178: JP2.11 21.59,70.26 22.71,69.14 26.26,69.14 27.69,67.72 27.69,40.51 28.93,39.27 28.93,32.87 31.42,30.38 38.18,30.38 38.89,29.67 40.84,29.67 41.02,29.84 41.02,30.34 R27.1
PC4
  Top 0.178: IC1.54 56.74,18.01 54.53,15.8 47.6,15.8 47.24,15.44 46.71,15.44 46.18,14.91 45.29,14.91 44.93,14.55 44.4,14.55 44.04,14.2 42.62,14.2 41.91,13.49 40.49,13.49 39.78,12.78 38.71,12.78 38.35,12.42 37.82,12.42 37.47,12.06 36.58,12.06 36.22,11.71 35.69,11.71 35.33,11.35 34.27,11.35 33.91,11 33.55,11 33.2,10.64 32.13,10.64 31.78,10.29 31.24,10.29 30.89,9.93 30,9.93 29.64,9.58 29.29,9.58 28.93,9.22 27.15,9.22 26.44,8.51 25.55,8.51 25.2,8.15 24.66,8.15 24.31,7.8 23.42,7.8 23.06,7.44 22.35,7.44 22,7.09 21.11,7.09 20.75,6.73 20.57,6.73 20.22,6.38 18.97,6.38 18.62,6.02 18.09,6.02 17.73,5.66 16.84,5.66 16.48,5.31 16.48,4.34 JP5.8
PC5
  Top 0.178: IC1.55 57.24,17.97 54.71,15.44 47.78,15.44 47.42,15.09 46.89,15.09 46.36,14.55 45.47,14.55 45.11,14.2 44.58,14.2 44.22,13.84 42.8,13.84 42.09,13.13 40.67,13.13 39.95,12.42 38.89,12.42 38.53,12.06 38,12.06 37.64,11.71 36.75,11.71 36.4,11.35 35.87,11.35 35.51,11 34.44,11 34.09,10.64 33.73,10.64 33.38,10.29 32.31,10.29 31.95,9.93 31.42,9.93 31.06,9.58 30.17,9.58 29.82,9.22 29.46,9.22 29.11,8.87 27.33,8.87 26.62,8.15 25.73,8.15 25.38,7.8 24.84,7.8 24.49,7.44 23.6,7.44 23.24,7.09 22.53,7.09 22.17,6.73 21.28,6.73 20.93,6.38 20.75,6.38 20.4,6.02 19.15,6.02 18.8,5.66 18.26,5.66 17.73,5.13 17.73,3.1 JP5.9
PC6
  Top 0.178: IC1.115 77.48,45.68 77.65,45.85 80.85,45.85 86.18,40.51 86.18,29.49 86.89,28.78 86.89,7.98 88.14,6.73 88.67,6.73 89.21,6.2 90.27,6.2 91.34,5.13 91.34,3.15 JP4.27
PC7
  Top 0.178: IC1.116 77.27,46.18 77.29,46.2 81.03,46.2 86.54,40.69 86.54,29.67 87.25,28.96 87.25,8.15 88.32,7.09 88.85,7.09 89.38,6.55 90.45,6.55 91.34,5.66 92.41,5.66 92.76,5.31 92.76,4.37 JP4.28
PC8
  Top 0.178: IC1.117 81.08,46.68 86.89,40.87 86.89,29.84 87.6,29.13 87.6,8.33 88.49,7.44 89.03,7.44 89.56,6.91 90.63,6.91 91.52,6.02 93.12,6.02 94,5.13 94,3.02 JP4.29
PC9
  Top 0.178: IC1.118 81.11,47.18 87.25,41.05 87.25,30.02 87.96,29.31 87.96,8.51 88.67,7.8 89.21,7.8 89.74,7.26 90.81,7.26 91.69,6.38 93.29,6.38 94,5.66 94.89,5.66 95.25,5.31 JP4.30
PC10
  Top 0.178: IC1.139 70.74,59.39 72.14,60.78 72.14,62.74 73.56,64.16 78.89,64.16 80.67,65.94 81.92,65.94 82.8,66.83 84.23,66.83 84.76,67.36 96.5,67.36 97.92,68.78 97.92,70.69 JP1.31
PC11
  Top 0.178: IC1.140 70.24,59.42 71.78,60.96 71.78,62.92 73.38,64.52 78.72,64.52 80.49,66.29 81.74,66.29 82.63,67.18 84.05,67.18 84.58,67.72 95.07,67.72 96.5,69.14 96.5,72.11 JP1.30
PC12
  Top 0.178: IC1.141 69.74,59.46 71.42,61.14 71.42,63.09 73.2,64.87 78.54,64.87 80.31,66.65 81.56,66.65 82.45,67.54 83.87,67.54 84.4,68.07 94,68.07 95.25,69.32 JP1.29
PC13
  Top 0.178: IC1.8 45.07,50.68 44.58,51.18 44.58,57.05 50.53,63.01 50.53,72.35 JP2.34
PC14
  Top 0.178: IC1.9 45.04,50.18 44.22,51 44.22,57.23 50.09,63.09 50.09,68.78 49.56,69.32 49.56,70.79 JP2.33
PC15
  Top 0.178: IC1.10 45.01,49.68 43.87,50.83 43.87,57.4 48.04,61.58 48.04,72.3 JP2.32
PD0
  Top 0.178: IC1.142 69.24,59.49 71.07,61.32 71.07,63.27 73.03,65.23 78.36,65.23 80.14,67 81.38,67 82.27,67.89 83.69,67.89 84.23,68.43 92.94,68.43 94,69.49 94,72.06 JP1.28
PD1
  Top 0.178: IC1.143 68.74,59.52 70.71,61.49 70.71,63.45 72.85,65.58 78.18,65.58 79.96,67.36 81.2,67.36 82.09,68.25 83.52,68.25 84.05,68.78 91.87,68.78 92.76,69.67 92.76,70.76 JP1.27
PD2
  Top 0.178: IC1.144 68.24,59.55 70.36,61.67 70.36,63.63 72.67,65.94 78,65.94 79.78,67.72 81.03,67.72 81.92,68.6 83.34,68.6 83.87,69.14 90.63,69.14 91.52,70.03 91.52,72.01 JP1.26
PD3  (via drill 0.33)
  Top 0.178: IC1.145 67.74,60.3 v68.94,61.49
  Bottom 0.178: v68.94,61.49 68.94,62.03 68.05,62.92 68.05,67.72 68.4,68.07 88.85,68.07 90.27,69.49 90.27,70.71 JP1.25
PD4  (via drill 0.33)
  Top 0.178: IC1.146 67.24,61.22 v67.51,61.49
  Bottom 0.178: v67.51,61.49 67.51,68.07 67.87,68.43 87.78,68.43 88.85,69.49 88.85,72.14 JP1.24
PD5  (via drill 0.33)
  Top 0.178: IC1.147 66.74,61.2 v66.45,61.49
  Bottom 0.178: v66.45,61.49 66.45,67.89 67.34,68.78 86.72,68.78 87.6,69.67 87.6,70.79 JP1.23
PD6  (via drill 0.33)
  Top 0.178: IC1.150 65.24,53.53 v65.2,53.49
  Bottom 0.178: v65.2,53.49 65.2,67.36 66.98,69.14 85.29,69.14 86.36,70.21 86.36,72.08 JP1.22
PD7
  Top 0.178: IC1.151 64.74,63.35 65.38,63.98 67.51,63.98 68.22,64.69 69.47,64.69 70.36,65.58 71.78,65.58 72.49,66.29 77.83,66.29 79.6,68.07 80.85,68.07 81.74,68.96 83.16,68.96 83.69,69.49 84.58,69.49 85.12,70.03 85.12,70.79 JP1.21
PD8
  Top 0.178: IC1.96 79.31,36.18 80.85,34.65 80.85,28.96 77.83,25.93 77.29,25.93 75.87,24.51 75.87,16.33 72.31,12.78 72.31,4.39 JP4.12
PD9
  Top 0.178: IC1.97 79.34,36.68 81.2,34.82 81.2,28.78 78,25.58 77.47,25.58 76.23,24.33 76.23,16.15 72.67,12.6 72.67,6.02 73.56,5.13 73.56,3.15 JP4.13
PD10
  Top 0.178: IC1.98 79.38,37.18 81.56,35 81.56,28.6 78.18,25.22 77.65,25.22 76.58,24.16 76.58,15.98 74.8,14.2 74.8,4.45 JP4.14
PD11
  Top 0.178: IC1.99 79.41,37.68 81.92,35.18 81.92,28.42 78.36,24.87 77.83,24.87 76.94,23.98 76.94,15.8 75.16,14.02 75.16,6.02 76.23,4.95 76.23,3.02 JP4.15
PD12
  Top 0.178: IC1.100 79.44,38.18 82.27,35.36 82.27,28.25 78.54,24.51 78,24.51 77.29,23.8 77.29,4.5 JP4.16
PD13
  Top 0.178: IC1.101 79.48,38.68 82.63,35.54 82.63,28.07 78.72,24.16 78.18,24.16 77.65,23.62 77.65,6.02 78.72,4.95 78.72,3.07 JP4.17
PD14
  Top 0.178: IC1.104 77.85,40.18 78,40.34 80.49,40.34 82.98,37.85 82.98,27.89 79.96,24.87 79.96,4.37 JP4.18
PD15
  Top 0.178: IC1.105 80.68,40.68 83.34,38.02 83.34,27.71 80.31,24.69 80.31,6.02 81.2,5.13 81.2,3.12 JP4.19
PE0
  Top 0.178: IC1.169 55.74,66.08 56.49,66.83 60.76,66.83 62.89,68.96 65.02,68.96 66.09,70.03 66.09,72.03 JP1.6
PE1
  Top 0.178: IC1.170 55.24,66.11 56.31,67.18 60.58,67.18 62.71,69.32 64.31,69.32 64.85,69.85 64.85,70.74 JP1.5
PE2
  Top 0.178: JP2.40 58.27,72.24 58.27,69.49 57.38,68.6 54,68.6 51.69,66.29 51.69,62.56 48.49,59.36 48.49,54.56 48.84,54.2 49.72,54.2 IC1.1
PE3
  Top 0.178: IC1.2 48.48,53.68 48.13,54.03 48.13,59.54 51.33,62.74 51.33,66.47 53.82,68.96 56.67,68.96 57.2,69.49 57.2,70.76 JP2.39
PE4
  Top 0.178: IC1.3 48.44,53.18 47.78,53.85 47.78,59.71 50.98,62.92 50.98,66.65 53.64,69.32 55.07,69.32 55.78,70.03 55.78,72.19 JP2.38
PE5  (via drill 0.33)
  Top 0.178: IC1.4 50.88,52.68 51.33,53.14 52.22,53.14 v52.76,53.67
  Bottom 0.178: v52.76,53.67 52.76,54.03 52.05,54.74 52.05,64.87 54.53,67.36 54.53,70.74 JP2.37
PE6  (via drill 0.33)
  Top 0.178: IC1.5 52.51,52.18 v52.93,52.6
  Bottom 0.178: v52.93,52.6 52.05,52.6 51.69,52.96 51.69,67.36 53.11,68.78 53.11,72.31 JP2.36
PE7
  Top 0.178: IC1.68 63.74,15.94 59.33,11.53 49.73,11.53 49.38,11.18 48.84,11.18 48.31,10.64 47.42,10.64 47.07,10.29 46.53,10.29 46.18,9.93 44.75,9.93 44.04,9.22 42.62,9.22 41.91,8.51 40.84,8.51 40.49,8.15 39.95,8.15 39.6,7.8 38.71,7.8 38.35,7.44 37.82,7.44 37.47,7.09 36.4,7.09 36.04,6.73 35.69,6.73 35.33,6.38 34.27,6.38 33.91,6.02 33.38,6.02 33.02,5.66 32.13,5.66 31.78,5.31 31.78,4.34 JP5.20
PE8
  Top 0.178: IC1.69 64.24,15.91 59.51,11.18 49.91,11.18 49.56,10.82 49.02,10.82 48.49,10.29 47.6,10.29 47.24,9.93 46.71,9.93 46.36,9.58 44.93,9.58 44.22,8.87 42.8,8.87 42.09,8.15 41.02,8.15 40.67,7.8 40.13,7.8 39.78,7.44 38.89,7.44 38.53,7.09 38,7.09 37.64,6.73 36.58,6.73 36.22,6.38 35.87,6.38 35.51,6.02 34.44,6.02 34.09,5.66 33.55,5.66 33.02,5.13 33.02,3.05 JP5.21
PE9
  Top 0.178: IC1.70 64.74,28.67 64.67,28.6 64.67,15.8 59.69,10.82 50.09,10.82 49.73,10.47 49.2,10.47 48.67,9.93 47.78,9.93 47.42,9.58 46.89,9.58 46.53,9.22 45.11,9.22 44.4,8.51 42.98,8.51 42.27,7.8 41.2,7.8 40.84,7.44 40.31,7.44 39.95,7.09 39.06,7.09 38.71,6.73 38.18,6.73 37.82,6.38 36.75,6.38 36.4,6.02 36.04,6.02 35.69,5.66 34.62,5.66 34.27,5.31 34.27,4.34 JP5.22
PE10
  Top 0.178: IC1.73 66.24,23.29 68.58,20.95 68.58,19.18 59.87,10.47 50.27,10.47 49.91,10.11 49.38,10.11 48.84,9.58 47.95,9.58 47.6,9.22 47.07,9.22 46.71,8.87 45.29,8.87 44.58,8.15 43.16,8.15 42.44,7.44 41.38,7.44 41.02,7.09 40.49,7.09 40.13,6.73 39.24,6.73 38.89,6.38 38.35,6.38 38,6.02 36.93,6.02 36.58,5.66 36.22,5.66 35.51,4.95 35.51,3.1 JP5.23
PE11
  Top 0.178: IC1.74 66.74,23.33 68.94,21.13 68.94,19 60.05,10.11 50.44,10.11 50.09,9.75 49.56,9.75 49.02,9.22 48.13,9.22 47.78,8.87 47.24,8.87 46.89,8.51 45.47,8.51 44.75,7.8 43.33,7.8 42.62,7.09 41.55,7.09 41.2,6.73 40.67,6.73 40.31,6.38 39.42,6.38 39.06,6.02 38.53,6.02 38.18,5.66 37.11,5.66 36.75,5.31 36.75,4.39 JP5.24
PE12
  Top 0.178: IC1.75 67.24,23.36 69.29,21.31 69.29,18.82 62.53,12.06 62.53,10.11 62.18,9.75 50.62,9.75 50.27,9.4 49.73,9.4 49.2,8.87 48.31,8.87 47.95,8.51 47.42,8.51 47.07,8.15 45.64,8.15 44.93,7.44 43.51,7.44 42.8,6.73 41.73,6.73 41.38,6.38 40.84,6.38 40.49,6.02 39.6,6.02 39.24,5.66 38.71,5.66 38.18,5.13 38.18,2.97 JP5.25
PE13
  Top 0.152: IC1.76
  Top 0.178: IC1.76 67.74,23.39 69.65,21.49 69.65,18.64 62.89,11.89 62.89,9.93 62.36,9.4 50.8,9.4 50.44,9.04 49.91,9.04 49.38,8.51 48.49,8.51 48.13,8.15 47.6,8.15 47.24,7.8 45.82,7.8 45.11,7.09 43.69,7.09 42.98,6.38 41.91,6.38 41.55,6.02 41.02,6.02 40.67,5.66 39.78,5.66 39.42,5.31 39.42,4.37 JP5.26
PE14
  Top 0.178: IC1.77 68.24,23.43 70,21.67 70,18.47 63.25,11.71 63.25,9.75 62.53,9.04 50.98,9.04 50.62,8.69 50.09,8.69 49.56,8.15 48.67,8.15 48.31,7.8 47.78,7.8 47.42,7.44 46,7.44 45.29,6.73 43.87,6.73 43.16,6.02 42.09,6.02 41.73,5.66 41.2,5.66 40.49,4.95 40.49,3.2 JP5.27
PE15
  Top 0.152: 68.73,30.17 IC1.78
  Top 0.178: IC1.78 68.74,23.46 70.36,21.84 70.36,18.29 63.6,11.53 63.6,9.58 62.71,8.69 51.16,8.69 50.8,8.33 50.27,8.33 49.73,7.8 48.84,7.8 48.49,7.44 47.95,7.44 47.6,7.09 46.18,7.09 45.47,6.38 44.04,6.38 43.33,5.66 42.27,5.66 41.91,5.31 JP5.28
PF0
  Top 0.178: IC1.16 47.55,46.68 47.24,46.38 44.58,46.38 42.44,48.51 42.44,58.12 42.98,58.65 42.98,72.29 JP2.28
PF1
  Top 0.178: IC1.17 47.58,46.18 47.42,46.02 44.4,46.02 42.09,48.34 42.09,58.29 42.44,58.65 42.44,68.78 41.91,69.32 JP2.27
PF2
  Top 0.178: IC1.18 47.61,45.68 47.42,45.49 44.4,45.49 41.73,48.16 41.73,65.94 40.49,67.18 40.49,72.24 JP2.26
PF3
  Top 0.178: IC1.19 47.83,45.18 47.6,44.96 44.4,44.96 41.38,47.98 41.38,65.76 39.42,67.72 39.42,70.76 JP2.25
PF4
  Top 0.178: IC1.20 48.04,44.68 47.78,44.43 44.4,44.43 41.02,47.8 41.02,65.58 38,68.6 38,72.19 JP2.24
PF5  (via drill 0.33)
  Top 0.178: IC1.21 48.78,44.18 v48.49,43.89
  Bottom 0.178: JP2.23 36.75,70.74 36.75,47.62 40.04,44.34 40.13,44.25 40.49,43.89 v48.49,43.89
PF6  (via drill 0.33)
  Top 0.178: IC1.24 50.41,42.68 50.62,42.47 51.69,42.47 v52.05,42.82
  Bottom 0.178: v52.05,42.82 52.05,43.71 51.69,44.07 50.8,44.07 49.91,43.18 46.71,43.18 46.36,43.54 40.31,43.54 36.4,47.45 36.4,68.78 35.51,69.67 35.51,72.14 JP2.22
PF7  (via drill 0.33)
  Top 0.178: IC1.25 50.37,42.18 50.44,42.11 52.76,42.11 v52.93,42.29
  Bottom 0.178: v52.93,42.29 52.76,42.29 52.58,42.11 49.56,42.11 48.84,42.82 46.53,42.82 46.18,43.18 40.13,43.18 36.04,47.27 36.04,67.54 34.27,69.32 34.27,70.79 JP2.21
PF8
  Top 0.178: IC1.26 45.75,41.68 45.64,41.58 43.16,41.58 42.8,41.94 42.8,45.49 40.67,47.62 40.67,65.41 36.58,69.49 33.55,69.49 33.02,70.03 33.02,72.08 JP2.20
PF9
  Top 0.178: IC1.27 43.02,41.18 42.44,41.76 42.44,45.31 40.31,47.45 40.31,65.23 36.4,69.14 32.13,69.14 31.78,69.49 31.78,70.79 JP2.19
PF10  (via drill 0.33)
  Top 0.178: IC1.28 50.79,40.68 v51.51,41.4
  Bottom 0.178: v51.51,41.4 51.33,41.4 50.98,41.76 49.38,41.76 48.67,42.47 46.71,42.47 45.82,41.58 44.93,41.58 43.69,42.82 39.95,42.82 35.69,47.09 35.69,67.36 33.73,69.32 31.42,69.32 30.53,70.21 30.53,72.03 JP2.18
PF11
  Top 0.178: IC1.59 59.24,15.17 58.09,14.02 48.49,14.02 48.13,13.67 47.6,13.67 47.07,13.13 46.18,13.13 45.82,12.78 45.29,12.78 44.93,12.42 43.51,12.42 42.8,11.71 41.38,11.71 40.67,11 39.6,11 39.24,10.64 38.71,10.64 38.35,10.29 37.47,10.29 37.11,9.93 36.58,9.93 36.22,9.58 35.15,9.58 34.8,9.22 34.44,9.22 34.09,8.87 33.02,8.87 32.66,8.51 32.13,8.51 31.78,8.15 30.89,8.15 30.53,7.8 30.17,7.8 29.82,7.44 28.04,7.44 27.33,6.73 26.44,6.73 26.09,6.38 25.55,6.38 25.2,6.02 24.31,6.02 23.95,5.66 23.24,5.66 22.71,5.13 22.71,3.2 JP5.13
PF12
  Top 0.178: JP5.14 24.13,5.31 24.49,5.66 25.38,5.66 25.73,6.02 26.26,6.02 26.62,6.38 27.51,6.38 28.22,7.09 30,7.09 30.35,7.44 30.71,7.44 31.06,7.8 31.95,7.8 32.31,8.15 32.84,8.15 33.2,8.51 34.27,8.51 34.62,8.87 34.98,8.87 35.33,9.22 36.4,9.22 36.75,9.58 37.29,9.58 37.64,9.93 38.53,9.93 38.89,10.29 39.42,10.29 39.78,10.64 40.84,10.64 41.55,11.35 42.98,11.35 43.69,12.06 45.11,12.06 45.47,12.42 46,12.42 46.36,12.78 47.24,12.78 47.78,13.31 48.31,13.31 48.67,13.67 58.27,13.67 59.6,15 59.6,29.22 59.74,29.36 IC1.60
PF13
  Top 0.178: JP5.15 25.38,3.07 25.38,5.13 25.91,5.66 26.44,5.66 26.8,6.02 27.69,6.02 28.4,6.73 30.17,6.73 30.53,7.09 30.89,7.09 31.24,7.44 32.13,7.44 32.49,7.8 33.02,7.8 33.38,8.15 34.44,8.15 34.8,8.51 35.15,8.51 35.51,8.87 36.58,8.87 36.93,9.22 37.47,9.22 37.82,9.58 38.71,9.58 39.06,9.93 39.6,9.93 39.95,10.29 41.02,10.29 41.73,11 43.16,11 43.87,11.71 45.29,11.71 45.64,12.06 46.18,12.06 46.53,12.42 47.42,12.42 47.95,12.95 48.49,12.95 48.84,13.31 58.45,13.31 61.38,16.24 61.38,29.22 61.24,29.36 IC1.63
PF14
  Top 0.178: IC1.64 61.74,16.07 58.62,12.95 49.02,12.95 48.67,12.6 48.13,12.6 47.6,12.06 46.71,12.06 46.36,11.71 45.82,11.71 45.47,11.35 44.04,11.35 43.33,10.64 41.91,10.64 41.2,9.93 40.13,9.93 39.78,9.58 39.24,9.58 38.89,9.22 38,9.22 37.64,8.87 37.11,8.87 36.75,8.51 35.69,8.51 35.33,8.15 34.98,8.15 34.62,7.8 33.55,7.8 33.2,7.44 32.66,7.44 32.31,7.09 31.42,7.09 31.06,6.73 30.71,6.73 30.35,6.38 28.58,6.38 27.86,5.66 26.98,5.66 26.62,5.31 26.62,4.37 JP5.16
PF15
  Top 0.178: IC1.65 62.24,16.04 58.8,12.6 49.2,12.6 48.84,12.24 48.31,12.24 47.78,11.71 46.89,11.71 46.53,11.35 46,11.35 45.64,11 44.22,11 43.51,10.29 42.09,10.29 41.38,9.58 40.31,9.58 39.95,9.22 39.42,9.22 39.06,8.87 38.18,8.87 37.82,8.51 37.29,8.51 36.93,8.15 35.87,8.15 35.51,7.8 35.15,7.8 34.8,7.44 33.73,7.44 33.38,7.09 32.84,7.09 32.49,6.73 31.6,6.73 31.24,6.38 30.89,6.38 30.53,6.02 28.75,6.02 27.86,5.13 27.86,3.12 JP5.17
PG0
  Top 0.178: IC1.66 62.74,16.01 58.98,12.24 49.38,12.24 49.02,11.89 48.49,11.89 47.95,11.35 47.07,11.35 46.71,11 46.18,11 45.82,10.64 44.4,10.64 43.69,9.93 42.27,9.93 41.55,9.22 40.49,9.22 40.13,8.87 39.6,8.87 39.24,8.51 38.35,8.51 38,8.15 37.47,8.15 37.11,7.8 36.04,7.8 35.69,7.44 35.33,7.44 34.98,7.09 33.91,7.09 33.55,6.73 33.02,6.73 32.66,6.38 31.78,6.38 31.42,6.02 31.06,6.02 30.71,5.66 29.64,5.66 29.29,5.31 29.29,4.39 JP5.18
PG1
  Top 0.178: IC1.67 63.24,15.97 59.16,11.89 49.56,11.89 49.2,11.53 48.67,11.53 48.13,11 47.24,11 46.89,10.64 46.36,10.64 46,10.29 44.58,10.29 43.87,9.58 42.44,9.58 41.73,8.87 40.67,8.87 40.31,8.51 39.78,8.51 39.42,8.15 38.53,8.15 38.18,7.8 37.64,7.8 37.29,7.44 36.22,7.44 35.87,7.09 35.51,7.09 35.15,6.73 34.09,6.73 33.73,6.38 33.2,6.38 32.84,6.02 31.95,6.02 31.6,5.66 31.24,5.66 30.53,4.95 30.53,3 JP5.19
PG2
  Top 0.178: IC1.106 80.71,41.18 83.69,38.2 83.69,27.53 83.43,27.27 83.34,27.18 82.55,26.39 JP4.20
PG3
  Top 0.178: IC1.107 80.74,41.68 84.05,38.38 84.05,27.36 82.98,26.29 82.98,6.02 83.87,5.13 83.87,3 JP4.21
PG4
  Top 0.178: IC1.108 80.78,42.18 84.4,38.56 84.4,28.6 85.09,27.91 JP4.22
PG5
  Top 0.178: IC1.109 80.81,42.68 84.76,38.73 84.76,28.78 85.47,28.07 85.47,6.02 86.36,5.13 86.36,3.05 JP4.23
PG6
  Top 0.178: IC1.110 80.84,43.18 85.12,38.91 85.12,28.96 85.83,28.25 85.83,7.44 87.43,5.84 87.43,4.52 JP4.24
PG7
  Top 0.178: IC1.111 80.88,43.68 85.47,39.09 85.47,29.13 86.18,28.42 86.18,7.62 87.78,6.02 88.32,6.02 88.85,5.49 88.85,3.1 JP4.25
PG8
  Top 0.178: IC1.112 80.91,44.18 85.83,39.27 85.83,29.31 86.54,28.6 86.54,7.8 87.96,6.38 88.49,6.38 89.03,5.84 89.56,5.84 90.09,5.31 90.09,4.39 JP4.26
PG9
  Top 0.178: IC1.152 64.24,63.38 65.2,64.34 67.34,64.34 68.05,65.05 69.29,65.05 70.18,65.94 71.6,65.94 72.31,66.65 77.65,66.65 79.43,68.43 80.67,68.43 81.56,69.32 82.98,69.32 83.87,70.21 83.87,72.03 JP1.20
PG10
  Top 0.178: IC1.153 63.74,63.41 65.02,64.69 67.16,64.69 67.87,65.41 69.11,65.41 70,66.29 71.42,66.29 72.14,67 77.47,67 79.25,68.78 80.49,68.78 81.38,69.67 82.27,69.67 82.63,70.03 82.63,70.74 JP1.19
PG11
  Top 0.178: IC1.154 63.24,63.45 64.85,65.05 66.98,65.05 67.69,65.76 68.94,65.76 69.83,66.65 71.25,66.65 71.96,67.36 77.29,67.36 79.07,69.14 80.31,69.14 81.2,70.03 81.2,72.16 JP1.18
PG12
  Top 0.178: IC1.155 62.74,63.48 64.67,65.41 66.8,65.41 67.51,66.12 68.76,66.12 69.65,67 71.07,67 71.78,67.72 77.11,67.72 78.89,69.49 79.6,69.49 80.14,70.03 80.14,70.69 JP1.17
PG13
  Top 0.178: IC1.156 62.24,63.51 64.49,65.76 66.62,65.76 67.34,66.47 68.58,66.47 69.47,67.36 70.89,67.36 71.6,68.07 76.76,68.07 78.72,70.03 78.72,72.11 JP1.16
PG14
  Top 0.178: IC1.157 61.74,63.55 64.31,66.12 66.45,66.12 67.16,66.83 68.4,66.83 69.29,67.72 70.71,67.72 71.42,68.43 76.4,68.43 77.47,69.49 JP1.15
PG15  (via drill 0.33)
  Top 0.178: IC1.160 60.24,55.47 v59.69,54.91
  Bottom 0.178: v59.69,54.91 59.69,64.69 64.49,69.49 75.51,69.49 76.23,70.21 76.23,72.06 JP1.14
PH2
  Top 0.178: IC1.43 46.49,33.18 45.29,31.98 44.75,31.98 44.22,31.45 44.22,30.02 42.98,28.78 41.73,28.78 41.55,28.6 38.35,28.6 37.64,29.31 30.89,29.31 27.86,32.33 27.86,38.73 26.62,39.98 26.62,67.18 25.73,68.07 22.17,68.07 21.46,68.78 20.57,68.78 20.22,69.14 19.15,69.14 18.8,69.49 18.26,69.49 17.73,70.03 17.73,72.14 JP2.8
PH3
  Top 0.178: IC1.44 46.53,32.68 45.47,31.62 44.93,31.62 44.58,31.27 44.58,29.84 43.16,28.42 41.91,28.42 41.73,28.25 38.18,28.25 37.47,28.96 30.71,28.96 27.51,32.16 27.51,38.56 26.26,39.8 26.26,67 25.55,67.72 22,67.72 21.28,68.43 20.4,68.43 20.04,68.78 18.97,68.78 18.62,69.14 18.09,69.14 17.73,69.49 16.84,69.49 16.48,69.85 16.48,70.79 JP2.7
PH4
  Top 0.178: IC1.45 52.24,19.37 51.16,18.29 46.36,18.29 46,17.93 45.47,17.93 44.93,17.4 44.04,17.4 43.69,17.04 43.16,17.04 42.8,16.69 41.38,16.69 40.67,15.98 39.24,15.98 38.53,15.26 37.47,15.26 37.11,14.91 36.58,14.91 36.22,14.55 35.33,14.55 34.98,14.2 34.44,14.2 34.09,13.84 33.02,13.84 32.66,13.49 32.31,13.49 31.95,13.13 30.89,13.13 30.53,12.78 30,12.78 29.64,12.42 28.75,12.42 28.4,12.06 28.04,12.06 27.69,11.71 25.91,11.71 25.2,11 24.31,11 23.95,10.64 23.42,10.64 23.06,10.29 22.17,10.29 21.82,9.93 21.11,9.93 20.75,9.58 19.86,9.58 19.51,9.22 19.33,9.22 18.97,8.87 17.73,8.87 17.37,8.51 16.84,8.51 16.48,8.15 15.6,8.15 15.24,7.8 14.71,7.8 14.35,7.44 13.46,7.44 13.11,7.09 12.57,7.09 12.22,6.73 11.15,6.73 10.8,6.38 10.08,6.38 9.73,6.02 9.02,6.02 8.66,5.66 8.31,5.66 7.77,5.13 7.77,2.9 JP5.1
PH5
  Top 0.178: IC1.46 52.74,19.34 51.33,17.93 46.53,17.93 46.18,17.58 45.64,17.58 45.11,17.04 44.22,17.04 43.87,16.69 43.33,16.69 42.98,16.33 41.55,16.33 40.84,15.62 39.42,15.62 38.71,14.91 37.64,14.91 37.29,14.55 36.75,14.55 36.4,14.2 35.51,14.2 35.15,13.84 34.62,13.84 34.27,13.49 33.2,13.49 32.84,13.13 32.49,13.13 32.13,12.78 31.06,12.78 30.71,12.42 30.17,12.42 29.82,12.06 28.93,12.06 28.58,11.71 28.22,11.71 27.86,11.35 26.09,11.35 25.38,10.64 24.49,10.64 24.13,10.29 23.6,10.29 23.24,9.93 22.35,9.93 22,9.58 21.28,9.58 20.93,9.22 20.04,9.22 19.69,8.87 19.51,8.87 19.15,8.51 17.91,8.51 17.55,8.15 17.02,8.15 16.66,7.8 15.77,7.8 15.42,7.44 14.88,7.44 14.53,7.09 13.64,7.09 13.28,6.73 12.75,6.73 12.4,6.38 11.33,6.38 10.97,6.02 10.26,6.02 9.91,5.66 9.2,5.66 8.84,5.31 8.84,4.37 JP5.2
PH6
  Top 0.178: IC1.83 71.24,28.78 71.42,28.6 71.42,17.76 64.67,11 64.67,9.04 63.25,7.62 51.69,7.62 51.33,7.26 50.8,7.26 50.27,6.73 49.38,6.73 49.02,6.38 48.49,6.38 48.13,6.02 46.71,6.02 45.82,5.13 45.82,2.95 JP5.31
PH7
  Top 0.178: JP5.32 46.89,4.42 46.89,5.31 47.24,5.66 48.31,5.66 48.67,6.02 49.2,6.02 49.56,6.38 50.44,6.38 50.98,6.91 51.51,6.91 51.87,7.26 64.85,7.26 65.02,7.44 65.02,10.82 71.83,17.63 71.83,29.26 71.78,29.31 71.78,30.15 IC1.84
PH8
  Top 0.178: IC1.85 72.24,17.51 65.38,10.64 65.38,7.26 65.02,6.91 52.05,6.91 51.69,6.55 51.16,6.55 50.62,6.02 49.73,6.02 49.38,5.66 48.84,5.66 48.31,5.13 48.31,3 JP5.33
PH9
  Top 0.178: IC1.86 72.74,17.47 65.73,10.47 65.73,7.09 65.2,6.55 52.22,6.55 51.87,6.2 51.33,6.2 50.8,5.66 49.91,5.66 49.56,5.31 49.56,4.34 JP5.34
PH10
  Top 0.178: IC1.87 73.24,17.44 66.09,10.29 66.09,6.91 65.38,6.2 52.4,6.2 52.05,5.84 51.51,5.84 50.8,5.13 50.8,3.05 JP5.35
PH11
  Top 0.178: IC1.88 73.74,17.41 66.45,10.11 66.45,6.73 65.56,5.84 52.58,5.84 52.05,5.31 52.05,4.34 JP5.36
PH12
  Top 0.178: IC1.89 76.24,27.55 74.09,25.4 74.09,17.22 66.8,9.93 66.8,5.84 65.91,4.95 65.91,3.18 JP4.7
PH13
  Top 0.178: IC1.128 77.58,52.18 77.83,52.43 82.63,52.43 84.23,50.83 84.23,47.8 89.74,42.29 89.74,31.27 90.45,30.56 90.45,10.29 90.98,9.75 92.05,9.75 92.94,8.87 94.54,8.87 95.25,8.15 96.5,8.15 97.38,7.26 100.05,7.26 100.76,6.55 101.3,6.55 101.83,6.02 102.72,6.02 103.07,5.66 103.61,5.66 104.14,5.13 104.14,3.05 JP4.37
PH14
  Top 0.178: IC1.129 77.55,52.68 77.65,52.78 82.8,52.78 84.58,51 84.58,47.98 90.09,42.47 90.09,31.45 90.81,30.73 90.81,10.47 91.16,10.11 92.23,10.11 93.12,9.22 94.72,9.22 95.43,8.51 96.67,8.51 97.56,7.62 100.23,7.62 100.94,6.91 101.47,6.91 102.01,6.38 102.9,6.38 103.25,6.02 103.78,6.02 104.14,5.66 105.03,5.66 105.38,5.31 105.38,4.34 JP4.38
PH15
  Top 0.178: IC1.130 82.94,53.18 84.94,51.18 84.94,48.16 90.45,42.65 90.45,31.62 91.16,30.91 91.16,11.71 93.29,9.58 94.89,9.58 95.61,8.87 96.85,8.87 97.74,7.98 100.41,7.98 101.12,7.26 101.65,7.26 102.18,6.73 103.07,6.73 103.43,6.38 103.96,6.38 104.32,6.02 105.21,6.02 105.56,5.66 106.1,5.66 106.63,5.13 106.63,3.1 JP4.39
PI0
  Top 0.178: IC1.131 82.97,53.68 85.29,51.36 85.29,48.34 90.81,42.82 90.81,31.8 91.52,31.09 91.52,11.89 93.47,9.93 95.07,9.93 95.78,9.22 97.03,9.22 97.92,8.33 100.58,8.33 101.3,7.62 101.83,7.62 102.36,7.09 103.25,7.09 103.61,6.73 104.14,6.73 104.5,6.38 105.38,6.38 105.74,6.02 106.27,6.02 106.63,5.66 107.7,5.66 107.87,5.49 107.87,4.39 JP4.40
PI1
  Top 0.178: IC1.132 83,54.18 85.65,51.54 85.65,48.51 91.16,43 91.16,31.98 91.87,31.27 91.87,12.06 93.65,10.29 95.25,10.29 95.96,9.58 97.21,9.58 98.09,8.69 100.76,8.69 101.47,7.98 102.01,7.98 102.54,7.44 103.43,7.44 103.78,7.09 104.32,7.09 104.67,6.73 105.56,6.73 105.92,6.38 106.45,6.38 106.81,6.02 107.87,6.02 108.23,5.66 108.76,5.66 109.3,5.13 109.3,3.12 JP3.1
PI2
  Top 0.178: JP1.35 102.9,70.79 102.9,68.96 100.58,66.65 85.12,66.65 84.58,66.12 83.16,66.12 82.27,65.23 81.03,65.23 78.18,62.38 78.18,59.18 77.29,58.29 74.62,58.29 73.74,57.41 IC1.133
PI3
  Top 0.178: JP1.34 101.47,72.21 101.47,68.96 99.52,67 84.94,67 84.4,66.47 82.98,66.47 82.09,65.58 80.85,65.58 77.83,62.56 77.83,59.36 77.11,58.65 74.45,58.65 73.24,57.44 IC1.134
PI4  (via drill 0.33)
  Top 0.178: IC1.173 53.74,55.9 v53.11,55.27
  Bottom 0.178: v53.11,55.27 53.11,65.41 55.07,67.36 57.02,67.36 59.16,69.49 62.89,69.49 63.42,70.03 63.42,72.16 JP1.4
PI5
  Top 0.178: IC1.174 53.24,66.25 54.53,67.54 60.4,67.54 62.36,69.49 62.36,70.69 JP1.3
PI6
  Top 0.178: IC1.175 52.74,66.28 54.36,67.89 59.16,67.89 60.76,69.49 60.76,72.29 JP1.2
PI7
  Top 0.178: IC1.176 52.24,66.31 54.18,68.25 58.45,68.25 59.69,69.49 JP1.1
PI8  (via drill 0.33)
  Top 0.178: IC1.7 50.8,51.18 v51.33,50.65
  Bottom 0.178: v51.33,50.65 51.33,67.72 52.05,68.43 52.05,70.79 JP2.35
PI9
  Top 0.178: IC1.11 44.97,49.18 43.51,50.65 43.51,57.58 47.6,61.67 47.6,68.78 47.07,69.32 47.07,70.74 JP2.31
PI10
  Top 0.178: IC1.12 44.94,48.68 43.16,50.47 43.16,57.76 45.64,60.25 45.64,72.16 JP2.30
PI11
  Top 0.178: IC1.13 44.91,48.18 42.8,50.29 42.8,57.94 45.11,60.25 45.11,68.78 44.58,69.32 44.58,70.69 JP2.29
USB_5V  (via drill 0.33)
  Top 0.406: X1.1 9.63,17.3 9.91,17.02 9.91,16.87 | 9.91,16.87 9.91,12.38 R2_PWR_LED.1 | 9.73,18.47 9.73,19.71 9.02,20.42 8.66,20.42 8.48,20.6 C4_USB_5V.1 | 9.73,18.47 9.73,17.04 9.91,16.87 | C3_USB_5V.+ 9.73,18.47
  other vias: 2.26,24.33 2.26,23.09 2.26,21.84
  pour Top (rank 5, no thermals): 9.02,20.42 1.19,20.42 1.02,20.6 1.02,43.18 2.62,44.78 2.62,69.14 4.57,71.09 6.17,71.09 7.24,72.16 7.24,73.23 8.31,74.3 9.55,74.3 10.08,73.76 10.08,70.21 9.55,69.67 4.39,69.67 3.51,68.78 3.51,22.2 4.75,20.95 9.02,20.95 9.19,20.78 9.19,20.6
  pour Route3 (no thermals): 1.55,22.38 1.55,24.69 1.91,25.04 3.15,25.04 3.33,24.87 3.33,23.44 4.39,22.38 13.11,22.38 15.06,20.42 15.06,9.4 16.66,7.8 56.13,7.8 57.91,6.02 57.91,5.13 58.09,4.95 58.09,1.04 57.73,0.69 56.31,0.69 55.96,1.04 55.96,5.31 55.07,6.2 15.6,6.2 13.28,8.51 13.28,19 11.68,20.6 2.26,20.6 1.55,21.31

## Text on the board
Document: STM32F439 CPU Module
tDocu: 5V | 2V8 | 1V8